# Altium schematic sheet homecomputer-6502_2.SchDoc: homecomputer-6502
size 286 x 202 mm; Date: 2018/12/4 21:08:25; SheetNumber: 3
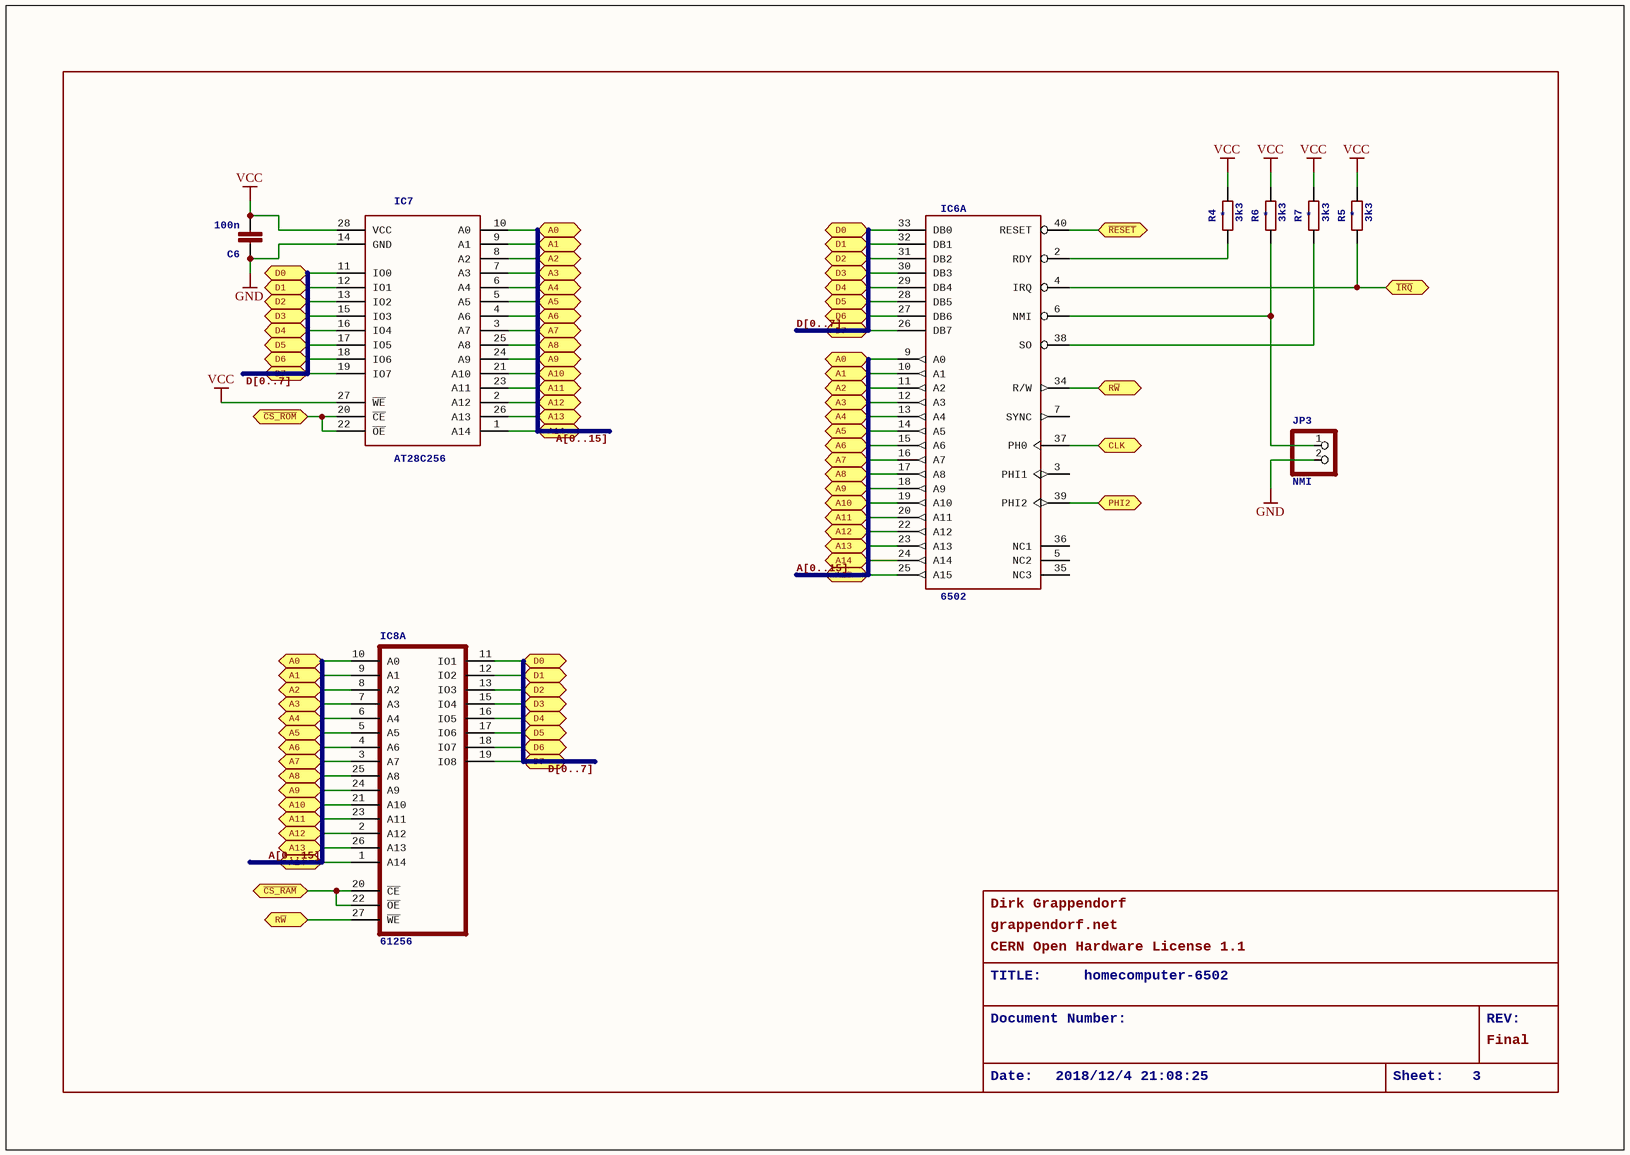
[diagram p0: homecomputer-6502_2.SchDoc]

## Parts
C6  100n  [C025-024X044]
IC6  6502  [DIP40]  (part A of 4)
IC7  AT28C256  [DIL28-6]
IC8  61256  [DIL28-3]  (part A of 2)
JP3  NMI  [1X02]
R4  3k3  [0204/7]
R5  3k3  [0204/7]
R6  3k3  [0204/7]
R7  3k3  [0204/7]

## Ports
A0, A1, A2, A3, A4, A5, A6, A7, A8, A9, A10, A11, A12, A13, A14, A15, CLK, D0, D1, D2, D3, D4, D5, D6, D7, PHI2, R~{W}, ~{CS_RAM}, ~{CS_ROM}, ~{IRQ}, ~{RESET}

## Nets
GND: C6.1 IC7.14(GND) JP3.2
VCC: C6.2 IC7.27(~{WE}) IC7.28(VCC) R4.2 R5.2 R6.2 R7.2
A0: IC6.9(A0) IC7.10(A0) IC8.10(A0) ; port A0
A1: IC6.10(A1) IC7.9(A1) IC8.9(A1) ; port A1
A2: IC6.11(A2) IC7.8(A2) IC8.8(A2) ; port A2
A3: IC6.12(A3) IC7.7(A3) IC8.7(A3) ; port A3
A4: IC6.13(A4) IC7.6(A4) IC8.6(A4) ; port A4
A5: IC6.14(A5) IC7.5(A5) IC8.5(A5) ; port A5
A6: IC6.15(A6) IC7.4(A6) IC8.4(A6) ; port A6
A7: IC6.16(A7) IC7.3(A7) IC8.3(A7) ; port A7
A8: IC6.17(A8) IC7.25(A8) IC8.25(A8) ; port A8
A9: IC6.18(A9) IC7.24(A9) IC8.24(A9) ; port A9
A10: IC6.19(A10) IC7.21(A10) IC8.21(A10) ; port A10
A11: IC6.20(A11) IC7.23(A11) IC8.23(A11) ; port A11
A12: IC6.22(A12) IC7.2(A12) IC8.2(A12) ; port A12
A14: IC6.24(A14) IC7.1(A14) IC8.1(A14) ; port A14
A15: IC6.25(A15) ; port A15
A[0..15]: IC6.23(A13) IC7.26(A13) IC8.26(A13) ; port A13
~{CS_RAM}: IC8.20(~{CE}) IC8.22(~{OE}) ; port ~{CS_RAM}
~{CS_ROM}: IC7.20(~{CE}) IC7.22(~{OE}) ; port ~{CS_ROM}
CLK: IC6.37(PH0) ; port CLK
D0: IC6.33(DB0) IC7.11(IO0) IC8.11(IO1) ; port D0
D1: IC6.32(DB1) IC7.12(IO1) IC8.12(IO2) ; port D1
D2: IC6.31(DB2) IC7.13(IO2) IC8.13(IO3) ; port D2
D3: IC6.30(DB3) IC7.15(IO3) IC8.15(IO4) ; port D3
D4: IC6.29(DB4) IC7.16(IO4) IC8.16(IO5) ; port D4
D5: IC6.28(DB5) IC7.17(IO5) IC8.17(IO6) ; port D5
D6: IC6.27(DB6) IC7.18(IO6) IC8.18(IO7) ; port D6
D7: IC6.26(DB7) IC7.19(IO7) IC8.19(IO8) ; port D7
~{IRQ}: IC6.4(IRQ) R5.1 ; port ~{IRQ}
PHI2: IC6.39(PHI2) ; port PHI2
~{RESET}: IC6.40(RESET) ; port ~{RESET}
R~{W}: IC6.34(R/W) IC8.27(~{WE}) ; port R~{W}
NetIC6_2: IC6.2(RDY) R4.1
NetIC6_6: IC6.6(NMI) JP3.1 R6.1
NetIC6_38: IC6.38(SO) R7.1

Not connected (* = marked no-connect by the designer): IC6 3(PHI1) 5(NC2) 7(SYNC) 35(NC3) 36(NC1)

## Buses and harness runs
bus A[0..15]
bus D[0..7]

## Notes on the sheet
- Dirk Grappendorf
- grappendorf.net
- CERN Open Hardware License 1.1
- TITLE:
- Document Number:
- homecomputer-6502
- REV:
- Date:
- 2018/12/4 21:08:25
- Sheet:
- 3
- Final

## Library data of the parts
C6 = C-EU025-024X044: CAPACITOR, European symbol
IC6 = 6502: 6502 processor
IC7 = AT28C256: EEPROM 32Kx8 256k bit   The AT28C256 is a high-performance Electrically Erasable and Programmable Read Only Memory. Its 256K of memory is organized as 32,768 words by 8 bits.
IC8 = 61256: MEMORY
JP3 = PINHD-1X2_2.54: PIN HEADER
R4-R7 = R-EU_0204/7: RESISTOR, European symbol; NAME: *